# EAGLE design vykObv (EAGLE 7.2.0)
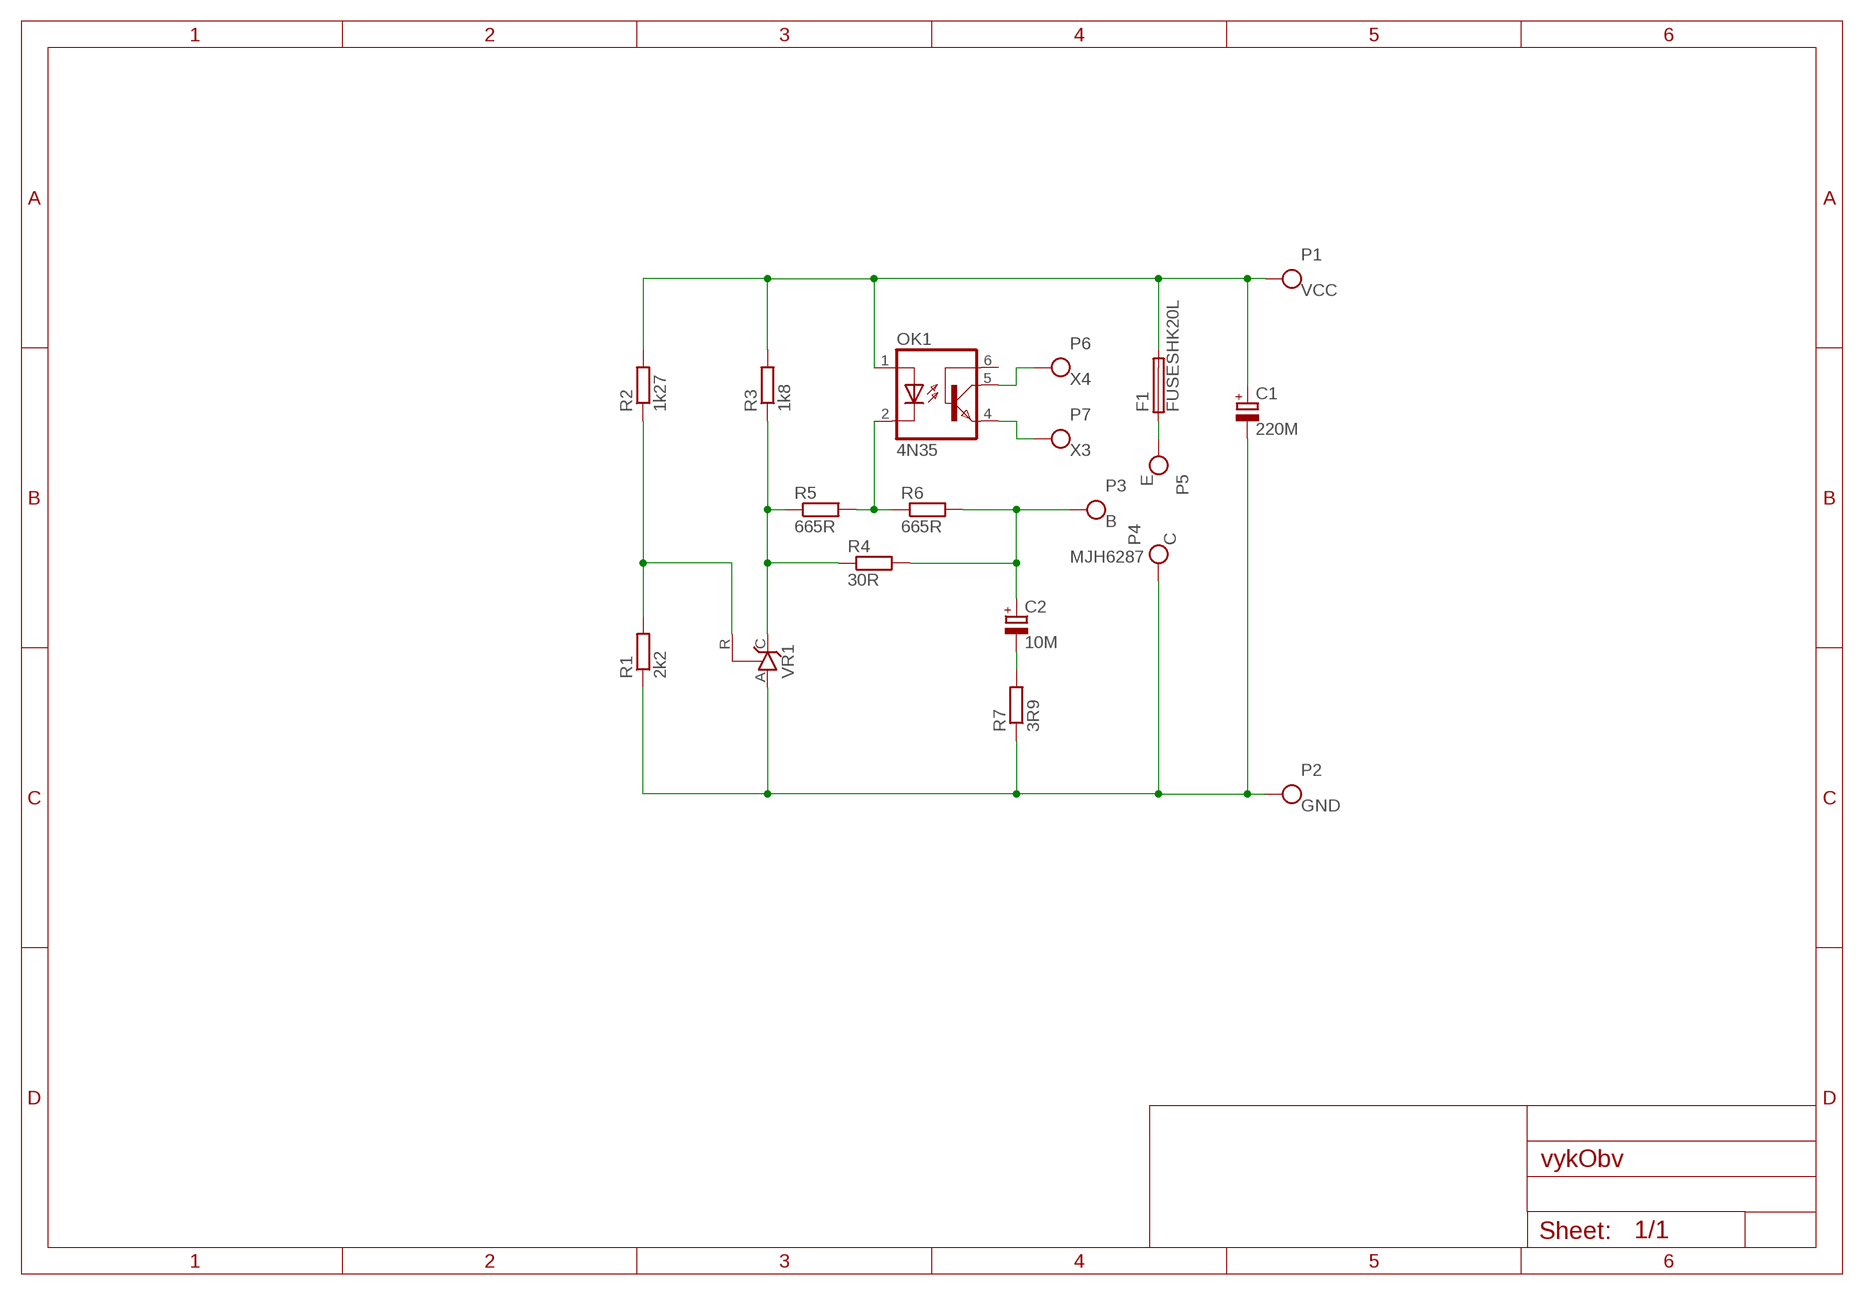
[diagram p0: schematic, sheet 1]

## Parts
C1  220M  CPOL-EUE3.5-8  [E3,5-8]
C2  10M  CPOL-EUE22-6AXIAL  [E22-6]
F1  FUSESHK20L  [SHK20L]
OK1  4N35  [DIL06]
P1  VCC  PADPAD2.5MM  [PAD2.5MM]
P2  GND  PADPAD2.5MM  [PAD2.5MM]
P3  B  PADPAD2.5MM  [PAD2.5MM]
P4  C  PADPAD2.5MM  [PAD2.5MM]
P5  E  PADPAD2.5MM  [PAD2.5MM]
P6  X4  PADPAD1.6MM  [PAD1.6MM]
P7  X3  PADPAD1.6MM  [PAD1.6MM]
R1  2k2  R-EU_0207/10  [0207/10]
R2  1k27  R-EU_0207/10  [0207/10]
R3  1k8  R-EU_0207/10  [0207/10]
R4  30R  R-EU_0207/10  [0207/10]
R5  665R  R-EU_0207/10  [0207/10]
R6  665R  R-EU_0207/10  [0207/10]
R7  3R9  R-EU_0207/10  [0207/10]
VR1  TL431CLP  [TO92-CLP]

## Nets
EMIT: F1.1A F1.1B P5.P$1
GND: C1.- P2.P$1 P4.P$1 R1.1 R7.1 VR1.A
N$5: OK1.2(C) R5.2 R6.1
N$6: C2.+ P3.P$1 R4.2 R6.2
N$7: R3.1 R4.1 R5.1 VR1.C
N$8: OK1.4(EMI) P7.P$1
N$9: OK1.5(COL) P6.P$1
N$11: R1.2 R2.1 VR1.R
N$13: C2.- R7.2
VDD: C1.+ F1.2A F1.2B OK1.1(A) P1.P$1 R2.2 R3.2
Unconnected: OK1.6(BAS)

## Notes on the sheet
- MJH6287

## Library data of the parts
C1 C2 = rcl:CPOL-EU: POLARIZED CAPACITOR, European symbol
F1 = fuse:FUSE: Fuse; OC_FARNELL: unknown; OC_NEWARK: unknown
OK1 = optocoupler:4N35: MOTOROLA OPTO COUPLER; MF: FAIRCHILD SEMICONDUCTOR; MPN: 4N35; OC_FARNELL: 1328375; OC_NEWARK: 72K9946
P1-P7 = PADs:PAD: Pady pro nyty
R1-R7 = rcl:R-EU_: RESISTOR, European symbol
VR1 = v-reg:TL431CLP: VOLTAGE REGULATOR

## Board
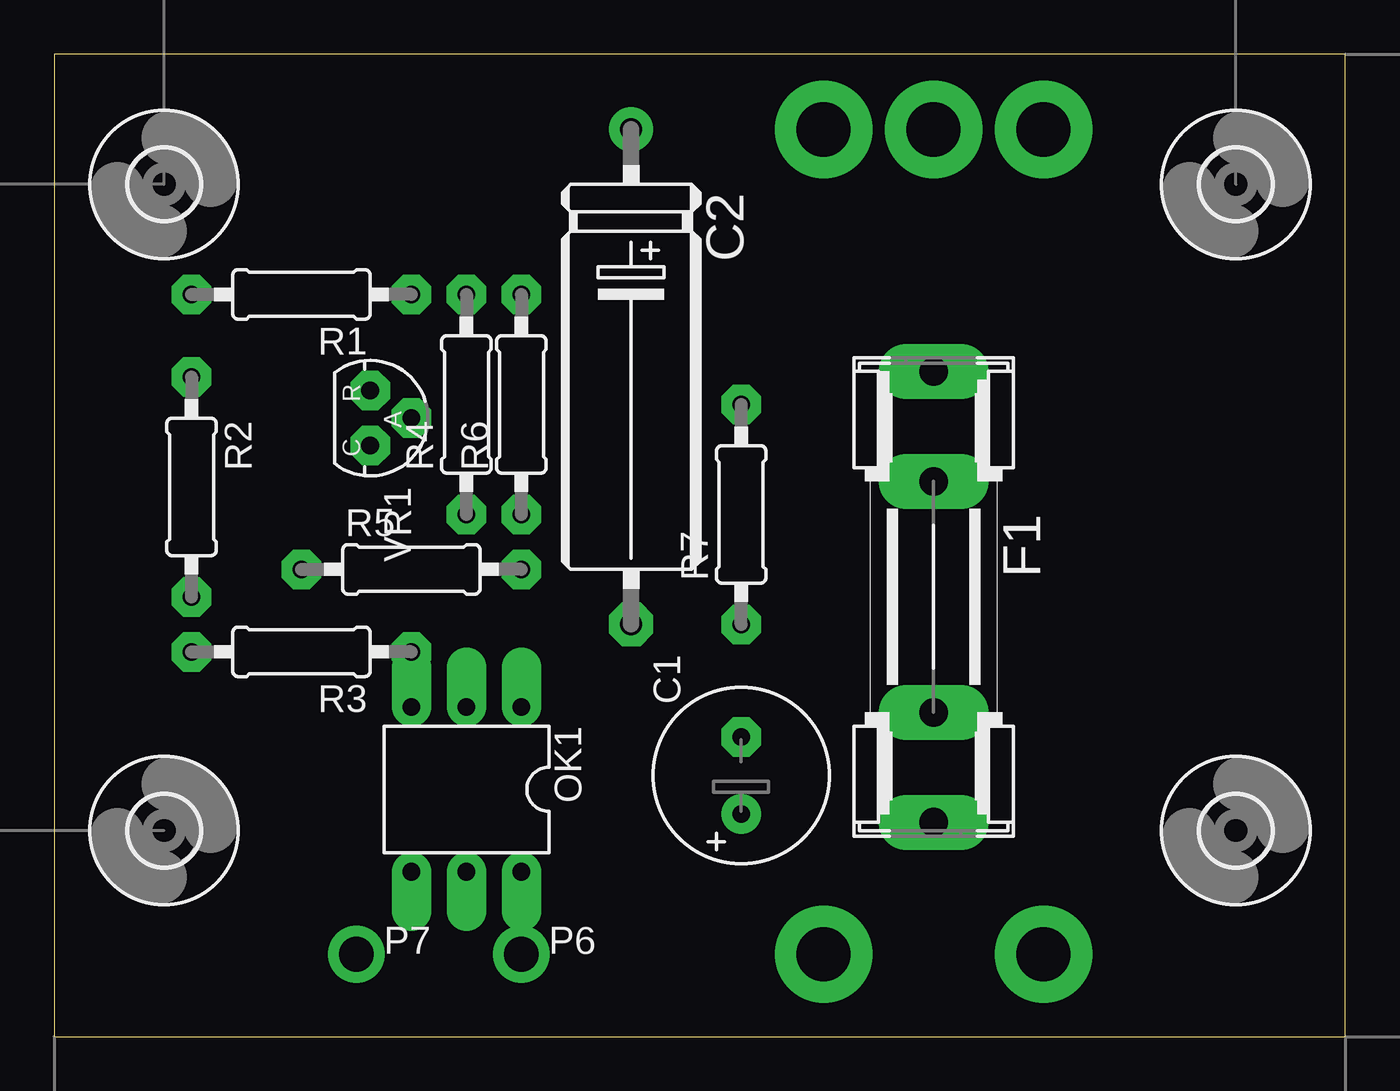
[diagram p1: board, top side]
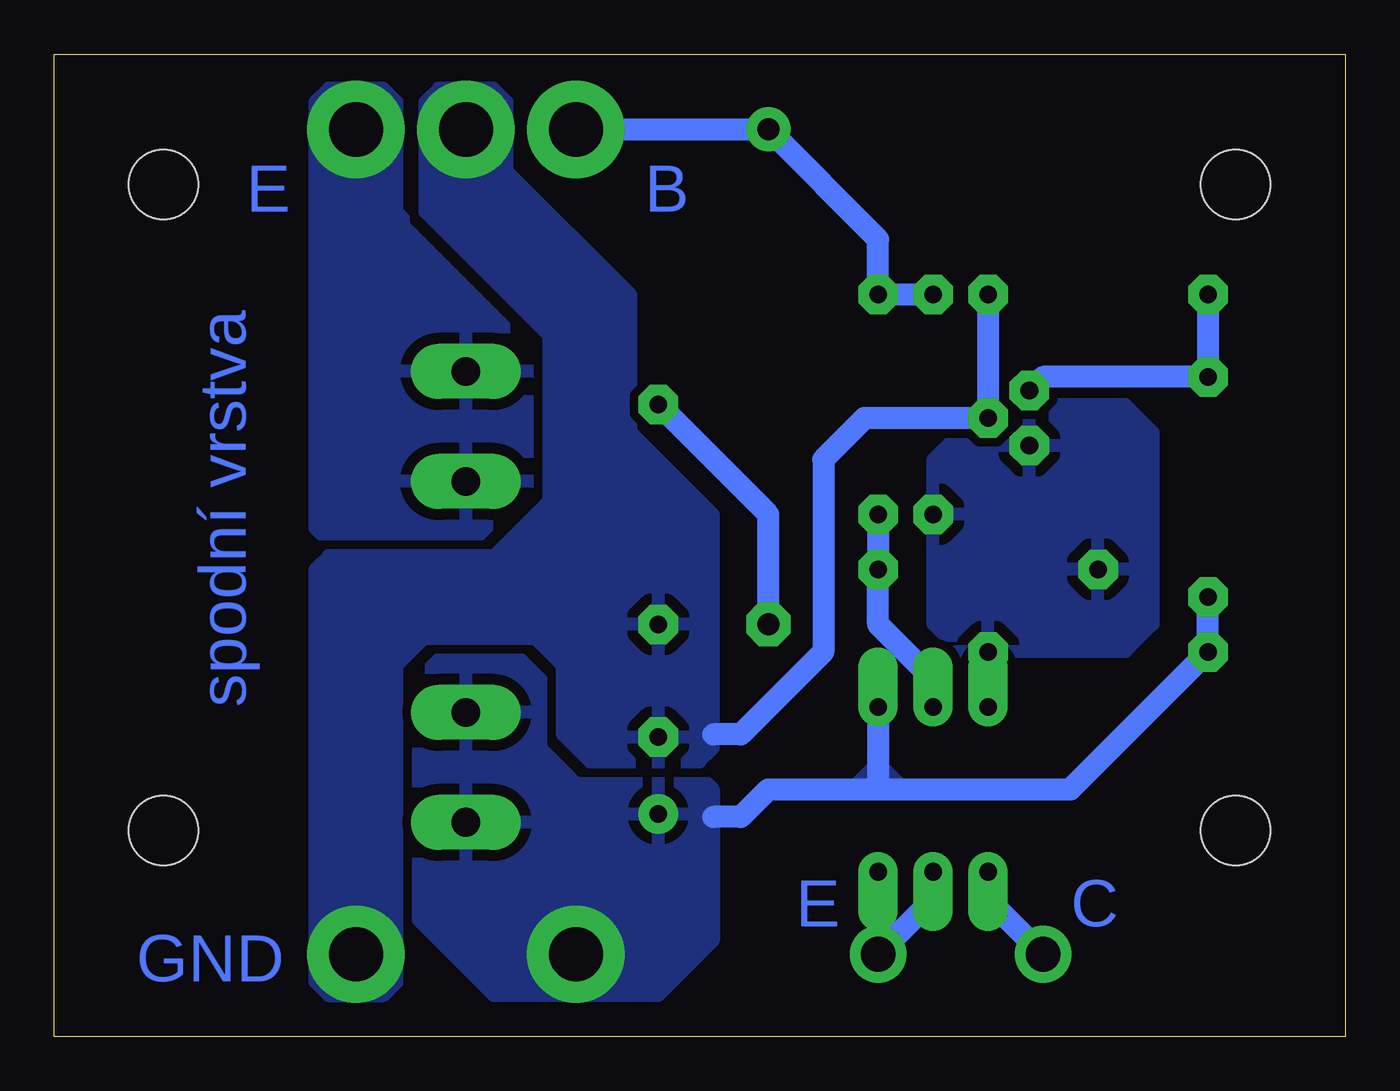
[diagram p2: board, bottom side, seen from below]

Size 59.67 x 45.39 mm. Coordinates in mm from the lower left corner, seen from the top.
Outline: 0,0 59.67,0 59.67,45.39 0,45.39 0,0
Copper layers (1*16): Top 0.035mm / dielectric 1.5mm / Bottom 0.035mm
Design rules "designRules": minimum track width 10mil, minimum drill 24mil, track to track 16mil, track to pad 10mil, pad to pad 8mil, via to via 8mil, smd to smd 8mil, copper to edge 20mil, drill to drill 8mil, minimum pad ring 20mil, minimum via ring 8mil, stop-mask expansion 4mil, vias tented up to drill 0mil, thermal gap 20mil

### Footprints (pad centres in the part's own frame; a part is rotated, then mirrored left to right if it is on the bottom)
E3,5-8 = drill 0.813 pad 1.6: + -1.778,0 | drill 0.813 pad 1.6 octagon: - 1.778,0
E22-6 = drill 1.016: + -11.43,0 | drill 1.016 octagon: - 11.43,0
SHK20L = drill 1.321 pad 2.54 long: 1A -10.414,0; 1B -5.334,0; 2A 10.414,0; 2B 5.334,0
DIL06 = drill 0.813 offset: 1 -2.54,-3.81; 2 0,-3.81; 3 2.54,-3.81; 4 2.54,3.81; 5 0,3.81; 6 -2.54,3.81
PAD2.5MM = drill 2.5 pad 4.5: P$1 0,0
PAD1.6MM = drill 1.6: P$1 0,0
0207/10 = drill 0.813 octagon: 1 -5.08,0; 2 5.08,0
3,2 = hole 3.2: 0,0
TO92-CLP = drill 0.813 octagon: A 0,1.905; C 1.27,0; R -1.27,0

### Placement (x,y rotation side)
C1  31.75,12.06 90 top
C2  26.67,30.48 270 top
F1  40.64,20.32 270 top
OK1  19.05,11.43 180 top
P1  35.56,3.81 0 top
P2  45.72,3.81 0 top
P3  35.56,41.91 0 top
P4  40.64,41.91 0 top
P5  45.72,41.91 0 top
P6  21.59,3.81 0 top
P7  13.97,3.81 0 top
R1  11.43,34.29 180 top
R2  6.35,25.4 270 top
R3  11.43,17.78 180 top
R4  19.05,29.21 90 top
R5  16.51,21.59 0 top
R6  21.59,29.21 90 top
R7  31.75,24.13 90 top
U$1  [3,2]  5.08,9.53 0 top
U$2  [3,2]  5.08,39.37 0 top
U$3  [3,2]  54.61,9.53 0 top
U$4  [3,2]  54.61,39.37 0 top
VR1  14.61,28.57 270 top

### Tracks (layer width: path | path; a pad name or v marks a point on that pad's centre or on a via)
EMIT
  pour Bottom (rank 2): 37.47,25.4 37.47,31.75 43.81,38.1 43.81,43.18 44.45,43.81 46.99,43.81 47.62,43.18 47.62,23.5 46.99,22.86 40.01,22.86
GND
  Bottom 1.016: R1.1 VR1.A 22.23,28.57 24.13,26.67 24.13,17.78 27.94,13.97 29.21,13.97 | 31.62,13.97 C1.-
  pour Bottom: 44.45,1.91 43.81,2.54 43.81,17.14 42.55,18.41 37.47,18.41 36.2,17.14 36.2,13.97 34.92,12.7 29.84,12.7 29.21,13.34 29.21,24.13 33.02,27.94 33.02,34.29 38.73,40.01 38.73,43.18 39.37,43.81 41.91,43.81 42.55,43.18 42.55,38.1 36.83,32.38 36.83,24.77 39.37,22.23 46.99,22.23 47.62,21.59 47.62,2.54 46.99,1.91
N$5
  Bottom 1.016: OK1.2 19.05,16.51 21.59,19.05 R5.2 R6.1
N$6
  Bottom 1.016: P3.P$1 C2.+ 21.59,36.83 R6.2 R4.2
N$7
  pour Bottom: 10.16,17.78 17.78,17.78 19.05,19.05 19.05,26.67 16.51,29.21 10.16,29.21 8.89,27.94 8.89,19.05
N$8
  Bottom 1.016: OK1.4 16.51,6.35 P7.P$1
N$9
  Bottom 1.016: OK1.5 19.05,6.35 P6.P$1
N$11
  Bottom 1.016: R1.2 R2.1 13.97,30.48 VR1.R
N$13
  Bottom 1.016: C2.- 26.67,24.13 R7.2
VDD
  Bottom 1.016: R2.2 R3.2 12.7,11.43 20.32,11.43 21.59,11.43 | 29.21,10.16 27.94,10.16 26.67,11.43 21.59,11.43 | OK1.1 21.59,11.43
  pour Bottom (rank 2): 31.75,1.91 39.37,1.91 43.18,5.71 43.18,16.51 41.91,17.78 38.1,17.78 36.83,16.51 36.83,13.34 35.56,12.06 29.84,12.06 29.21,11.43 29.21,4.45
  pour Bottom: 20.32,11.43 22.86,11.43 21.59,12.7

### Text on the board
Bottom: B | E | spodní vrstva | C | E | GND